# EAGLE design smallDevV2 (EAGLE 6.5.0)
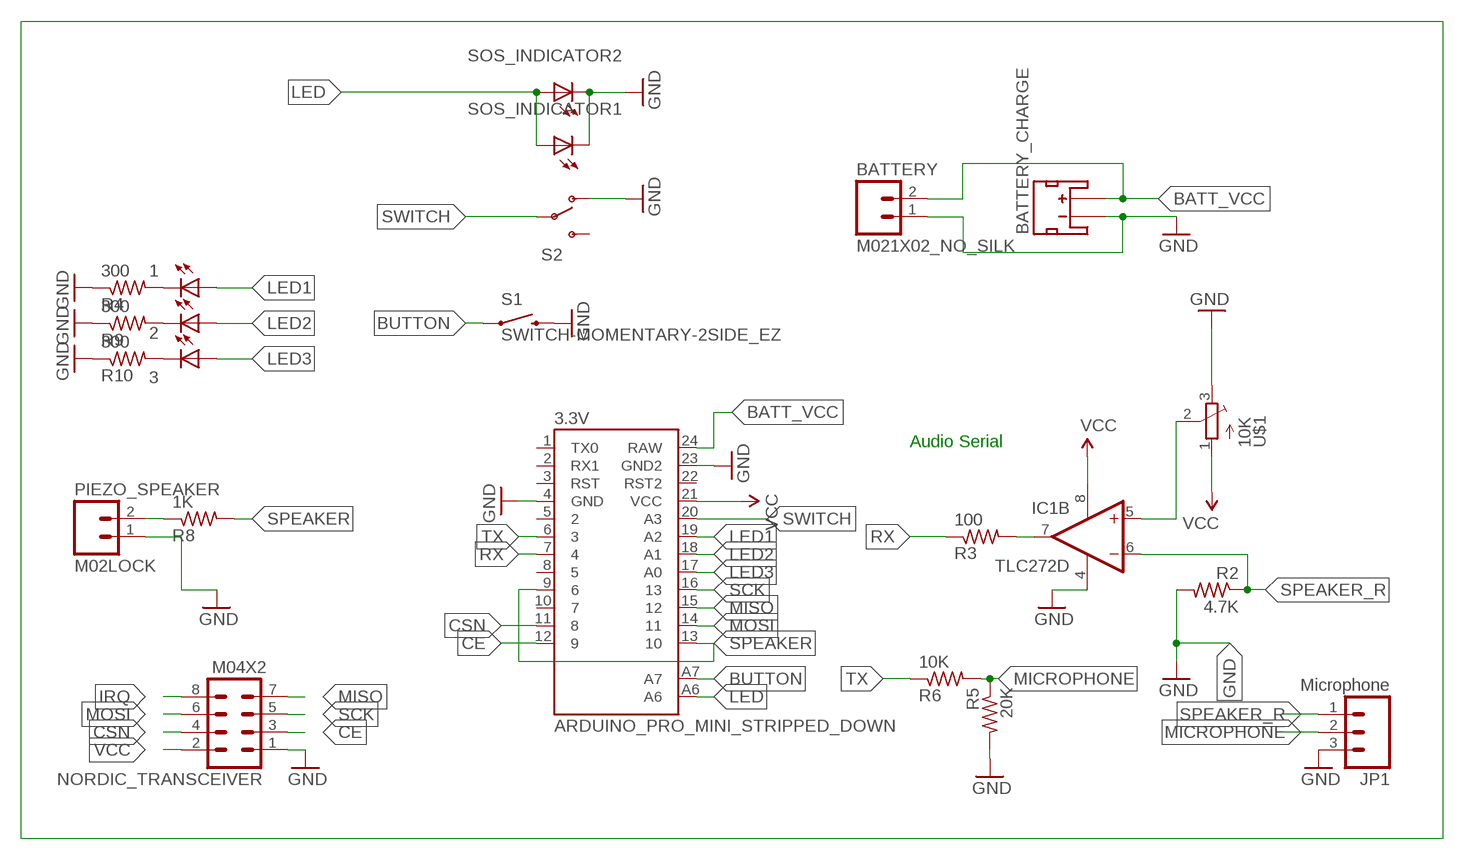
[diagram p0: schematic, sheet 1]

## Parts
1  LEDCHIP-LED0805  [CHIP-LED0805]
2  LEDCHIP-LED0805  [CHIP-LED0805]
3  LEDCHIP-LED0805  [CHIP-LED0805]
3.3V  ARDUINO_PRO_MINI_STRIPPED_DOWN  [ARDUINO_PRO_MINI_STRIPPED_DOWN]
BATTERY  M021X02_NO_SILK  [1X02_NO_SILK]
BATTERY_CHARGE  JST_2MM_MALE  [JST-2-SMD]
IC1  TLC272D  [SO08]
JP1  Microphone  M03LOCK  [1X03_LOCK]
NORDIC_TRANSCEIVER  M04X2  [2X4]
PIEZO_SPEAKER  M02LOCK  [1X02_LOCK]
R2  4.7K  R-US_M0805  [M0805]
R3  100  R-US_M0805  [M0805]
R4  300  R-US_M0805  [M0805]
R5  20K  R-US_M0805  [M0805]
R6  10K  R-US_M0805  [M0805]
R8  1K  R-US_M0805  [M0805]
R9  300  R-US_M0805  [M0805]
R10  300  R-US_M0805  [M0805]
S1  SWITCH-MOMENTARY-2SIDE_EZ  [TACTILE-PTH-SIDEEZ]
S2  SWITCH-SPDT-SMD-A  [SWITCH-SPST-SMD-A]
SOS_INDICATOR1  LEDCHIP-LED0805  [CHIP-LED0805]
SOS_INDICATOR2  LEDCHIP-LED0805  [CHIP-LED0805]
U$1  10K  TRIMPOTTC33X  [TC33X]

## Nets
BATT_VCC: 3.3V.24(RAW) BATTERY.2 BATTERY_CHARGE.2(+)
BUTTON: 3.3V.A7 S1.1
CE: 3.3V.12 NORDIC_TRANSCEIVER.3
CSN: 3.3V.11 NORDIC_TRANSCEIVER.4
GND: 3.3V.4(GND) 3.3V.23(GND2) BATTERY.1 BATTERY_CHARGE.1(-) IC1.4(P:V-) JP1.3 NORDIC_TRANSCEIVER.1 PIEZO_SPEAKER.1 R2.2 R4.1 R5.2 R9.1 R10.1 S1.2 S2.1(O) SOS_INDICATOR1.C SOS_INDICATOR2.C U$1.3(E)
IRQ: NORDIC_TRANSCEIVER.8
LED: 3.3V.A6 SOS_INDICATOR1.A SOS_INDICATOR2.A
LED1: 1.A 3.3V.19(A2)
LED2: 2.A 3.3V.18(A1)
LED3: 3.3V.17(A0) 3.A
MICROPHONE: JP1.2 R5.1 R6.2
MISO: 3.3V.15 NORDIC_TRANSCEIVER.7
MOSI: 3.3V.14 NORDIC_TRANSCEIVER.6
N$3: IC1.5(B:+IN) U$1.2(S)
N$4: IC1.7(B:OUT) R3.2
N$6: 1.C R4.2
N$8: PIEZO_SPEAKER.2 R8.1
N$13: 2.C R9.2
N$14: 3.C R10.2
RX: 3.3V.7 R3.1
SCK: 3.3V.16 NORDIC_TRANSCEIVER.5
SPEAKER: 3.3V.9 3.3V.13 R8.2
SPEAKER_R: IC1.6(B:-IN) JP1.1 R2.1
SWITCH: 3.3V.20(A3) S2.2(P)
TX: 3.3V.6 R6.1
VCC: 3.3V.21(VCC) IC1.8(P:V+) NORDIC_TRANSCEIVER.2 U$1.1(A)
Unconnected: 3.3V.1(TX0) 3.3V.2(RX1) 3.3V.3(RST) 3.3V.5 3.3V.8 3.3V.10 3.3V.22(RST2) BATTERY_CHARGE.NC1(PAD1) BATTERY_CHARGE.NC2(PAD2) IC1.1(A:OUT) IC1.2(A:-IN) IC1.3(A:+IN) S2.3(S)

## Notes on the sheet
- Audio Serial

## Library data of the parts
1-3 SOS_INDICATOR1 SOS_INDICATOR2 = adafruit:LED: LED OSRAM: - CHIPLED LG R971, LG N971, LY N971, LG Q971, LY Q971, LO R971, LY R971 LH N974, LH R974 LS Q976, LO Q976, LY Q976 LO Q996 - Hyper CHIPLED LW Q18S LB Q993, LB Q99A, LB R99A - SideLED LS A670, LO A670, LY A670, LG A670, LP A670 LB A673, LV A673, LT A673, LW A673 LH A674 LY A675 LS A676, LA A676, LO A676, LY A676, LW A676 LS A679, LY A679, LG A679 - Hyper Micro SIDELED® LS Y876, LA Y876, LO Y876, LY Y876 LT Y87S - SmartLED LW L88C, LW L88S LB L89C, LB L89S, LG L890 LS L89K, LO L89K, LY L89K LS L896, LA L896, LO L896, LY L896 - TOPLED LS T670, LO T670, LY T670, LG T670, LP T670 LSG T670, LSP T670, LSY T670, LOP T670, LYG T670 LG T671, LOG T671, LSG T671 LB T673, LV T673, LT T673, LW T673 LH T674 LS T676, LA T676, LO T676, LY T676, LB T676, LH T676, LSB T676, LW T676 LB T67C, LV T67C, LT T67C, LS T67K, LO T67K, LY T67K, LW E67C LS E67B, LA E67B, LO E67B, LY E67B, LB E67C, LV E67C, LT E67C LW T67C LS T679, LY T679, LG T679 LS T770, LO T770, LY T770, LG T770, LP T770 LB T773, LV T773, LT T773, LW T773 LH T774 LS E675, LA E675, LY E675, LS T675 LS T776, LA T776, LO T776, LY T776, LB T776 LHGB T686 LT T68C, LB T68C - Hyper Mini TOPLED® LB M676 - Mini TOPLED Santana® LG M470 LS M47K, LO M47K, LY M47K Source: http://www.osram.convergy.de/
3.3V = myLibrary:ARDUINO_PRO_MINI_STRIPPED_DOWN
BATTERY PIEZO_SPEAKER = SparkFun-Connectors:M02: Standard 2-pin 0.1" header. Use with - straight break away headers ( PRT-00116) - right angle break away headers (PRT-00553) - swiss pins (PRT-00743) - machine pins (PRT-00117) - female headers (PRT-00115) Molex polarized connector foot print use with: PRT-08233 with associated crimp pins and housings. 2.54_SCREWTERM for use with PRT-10571. 3.5mm Screw Terminal footprints for PRT-08084 5mm Screw Terminal footprints for use with PRT-08433
BATTERY_CHARGE = SparkFun-Connectors:JST_2MM_MALE: Mates to single-cell LiPo batteries. CONN-08352; PROD_ID: CONN-08352
IC1 = linear:TLC272: OP AMP
JP1 = SparkFun-Connectors:M03: Header 3 Standard 3-pin 0.1" header. Use with straight break away headers (SKU : PRT-00116), right angle break away headers (PRT-00553), swiss pins (PRT-00743), machine pins (PRT-00117), and female headers (PRT-00115). Molex polarized connector foot print use with SKU : PRT-08232 with associated crimp pins and housings.
NORDIC_TRANSCEIVER = SparkFun-Connectors:M04X2: .1" header, two rows of four.
R2-R6 R8-R10 = adafruit:R-US_: RESISTOR, American symbol
S1 = SparkFun-Electromechanical:SWITCH-MOMENTARY-2: Various NO switches- pushbuttons, reed, etc
S2 = SparkFun-Electromechanical:SWITCH-SPDT: SPDT Switch Simple slide switch, Spark Fun Electronics SKU : COM-00102 DPDT SMT slide switch, AYZ0202, SWCH-08179
U$1 = adafruit:TRIMPOT: SMT trimmer potentiometer part number TC33X http://www.ladyada.net/library/eagle

## Board
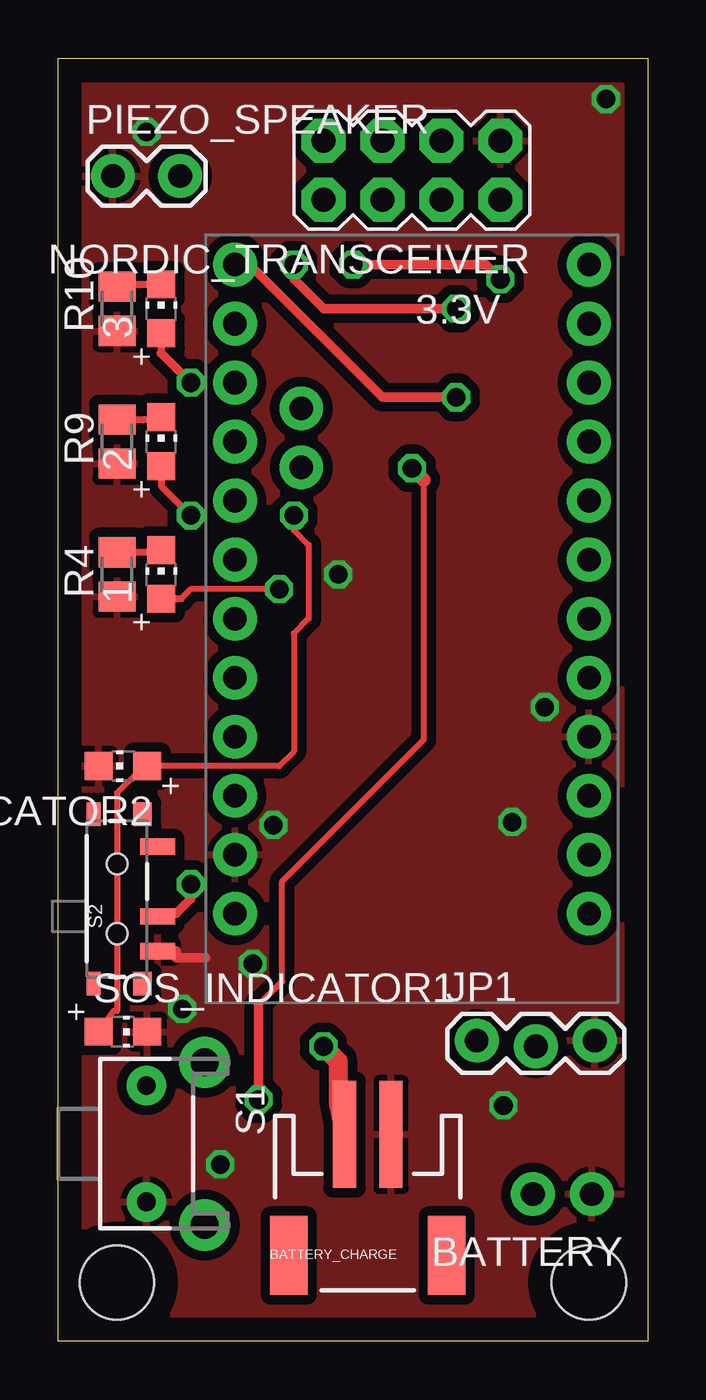
[diagram p1: board, top side]
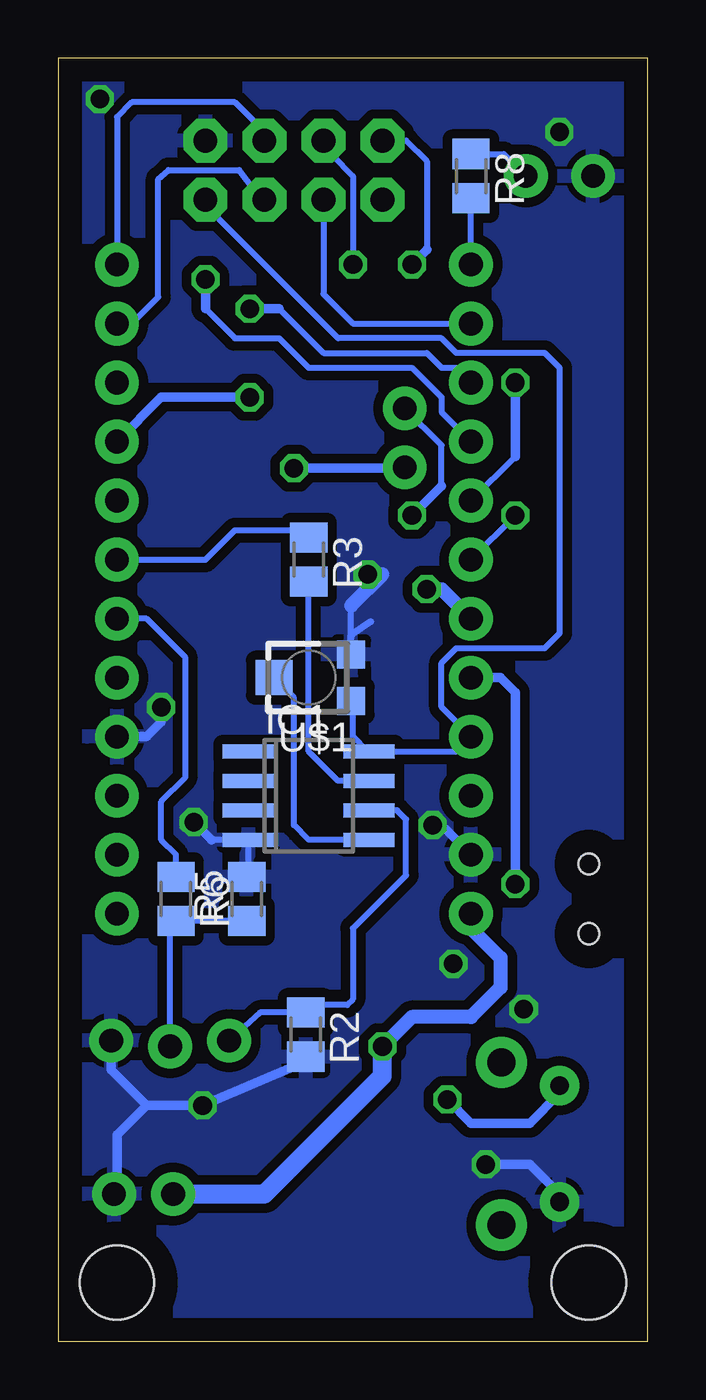
[diagram p2: board, bottom side, seen from below]

Size 25.4 x 55.24 mm. Coordinates in mm from the lower left corner, seen from the top.
Outline: 0,0 0,55.24 25.4,55.24 25.4,0 0,0
Copper layers (1*16): Top 0.035mm / dielectric 1.5mm / Bottom 0.035mm
Design rules "default": minimum track width 10mil, minimum drill 24mil, track to track 8mil, track to pad 8mil, pad to pad 8mil, via to via 8mil, smd to smd 8mil, copper to edge 40mil, drill to drill 8mil, minimum pad ring 10mil, minimum via ring 8mil, stop-mask expansion 4mil, vias tented up to drill 0mil, thermal gap 10mil
Holes 3.2 mm at 2.54,2.54 22.86,2.54

### Footprints (pad centres in the part's own frame; a part is rotated, then mirrored left to right if it is on the bottom)
CHIP-LED0805 = smd 1.2 x 1.2: A 0,-1.05; C 0,1.05
ARDUINO_PRO_MINI_STRIPPED_DOWN = drill 1.016 pad 1.88: 1 -7.62,13.97; 2 -7.62,11.43; 3 -7.62,8.89; 4 -7.62,6.35; 5 -7.62,3.81; 6 -7.62,1.27; 7 -7.62,-1.27; 8 -7.62,-3.81; 9 -7.62,-6.35; 10 -7.62,-8.89; 11 -7.62,-11.43; 12 -7.62,-13.97; 13 7.62,-13.97; 14 7.62,-11.43; 15 7.62,-8.89; 16 7.62,-6.35; 17 7.62,-3.81; 18 7.62,-1.27; 19 7.62,1.27; 20 7.62,3.81; 21 7.62,6.35; 22 7.62,8.89; 23 7.62,11.43; 24 7.62,13.97; A6 4.763,-7.779; A7 4.763,-5.239
1X02_NO_SILK = drill 1.016 pad 1.88: 1 0,0; 2 2.54,0
JST-2-SMD = smd 1 x 4.6: 1 -1,-3.7; 2 1,-3.7 | smd 1.6 x 3.4: NC1 -3.4,1.5; NC2 3.4,1.5
SO08 = smd 0.6 x 2.2: 1 -1.905,-2.6; 2 -0.635,-2.6; 3 0.635,-2.6; 4 1.905,-2.6; 5 1.905,2.6; 6 0.635,2.6; 7 -0.635,2.6; 8 -1.905,2.6
1X03_LOCK = drill 1.016 pad 1.88: 1 0,0.127; 2 2.54,-0.127; 3 5.08,0.127
2X4 = drill 1.016 pad 1.88 octagon: 1 -3.81,-1.27; 2 -3.81,1.27; 3 -1.27,-1.27; 4 -1.27,1.27; 5 1.27,-1.27; 6 1.27,1.27; 7 3.81,-1.27; 8 3.81,1.27
1X02_LOCK = drill 1.016 pad 1.88: 1 -0.178,0; 2 2.718,0
M0805 = smd 1.3 x 1.6: 1 -0.95,0; 2 0.95,0
TACTILE-PTH-SIDEEZ = drill 0.8 pad 1.7: 1 -2.5,0; 2 2.5,0 | drill 1.2 pad 2.2: ANCHOR1 -3.5,2.5; ANCHOR2 3.5,2.5
SWITCH-SPST-SMD-A = smd 0.7 x 1.5: 1 -2.25,-1.75; 2 -0.75,-1.75; 3 2.25,-1.75 | smd 1 x 0.6: GND1 -3.65,1; GND3 3.65,1 | smd 1 x 0.8: GND2 -3.65,-1.1; GND4 3.65,-1.1 | hole 0.9: -1.5,0; 1.5,0
TC33X = smd 1.2 x 1.2: 1 -1,-1.825; 3 1,-1.825 | smd 1.5 x 1.6: 2 0,1.5

### Placement (x,y rotation side)
1  4.45,33.02 0 top
2  4.45,38.73 0 top
3  4.45,44.45 0 top
3.3V  15.24,32.38 180 top
BATTERY  22.99,6.35 180 top
BATTERY_CHARGE  13.34,5.21 180 top
IC1  14.61,23.5 270 bottom
JP1  18.03,12.83 0 top
NORDIC_TRANSCEIVER  15.24,50.42 180 top
PIEZO_SPEAKER  2.54,50.16 0 top
R2  14.73,13.21 270 bottom
R3  14.61,33.66 270 bottom
R4  2.54,33.02 90 top
R5  17.27,19.05 90 bottom
R6  20.32,19.05 270 bottom
R8  7.62,50.16 270 bottom
R9  2.54,38.73 90 top
R10  2.54,44.45 90 top
S1  3.81,8.51 270 top
S2  2.54,19.05 90 top
SOS_INDICATOR1  2.79,13.34 270 top
SOS_INDICATOR2  2.79,24.77 90 top
U$1  14.61,28.57 90 bottom

### Tracks (layer width: path | path; a pad name or v marks a point on that pad's centre or on a via)
BATT_VCC  (via drill 0.8)
  Top 0.813: v11.43,12.7 12.06,12.06 12.06,10.32 BATTERY_CHARGE.2
  Bottom 0.61: v11.43,12.7 10.16,13.97 7.62,13.97 6.35,15.24 6.35,16.51 7.62,17.78 3.3V.24
  Bottom 0.813: BATTERY.2 16.51,6.35 11.43,11.43 v11.43,12.7
BUTTON  (via drill 0.8)
  Top 0.254: 8.64,14.48 9.65,15.49 9.65,19.81 15.75,25.91 15.75,37.08
  Top 0.406: v8.64,10.41 8.64,14.48
  Top 0.61: 15.75,37.08 v15.24,37.59
  Bottom 0.254: 10.51,37.59 3.3V.A7
  Bottom 0.406: S1.1 3.81,10.67 5.08,9.4 7.62,9.4 v8.64,10.41 | v15.24,37.59 10.51,37.59
CE
  Bottom 0.254: NORDIC_TRANSCEIVER.3 16.51,52.07 17.78,53.34 22.23,53.34 22.86,52.7 3.3V.12
CSN
  Bottom 0.254: NORDIC_TRANSCEIVER.4 16.64,49.15 17.6,50.42 20.65,50.42 21.08,50.04 21.08,44.96 22.23,43.81 3.3V.11
GND  (via drill 0.8)
  Top 0.406: S2.1 5.08,16.8 5.08,16.51 6.35,16.51
  Bottom 0.254: U$1.3 12.78,31.67 | R2.2 14.73,12.06 | R5.2 17.2,20 IC1.4 18.8,21.59
  Bottom 0.305: U$1.3 12.78,30.4 12.7,30.48 11.94,30.99
  Bottom 0.406: 14.73,12.06 v19.18,10.16 21.59,10.16 | 18.8,21.59 v19.56,22.35 | S1.2 3.81,6.35 5.08,7.62 v6.99,7.62 | v9.27,22.23 8.89,22.23 3.3V.23 | v20.95,27.3 20.95,26.67 21.59,26.04 3.3V.4 | 21.59,10.16 22.86,8.89 22.86,6.48 BATTERY.1 | JP1.3 23.11,11.68 21.59,10.16
  Bottom 0.61: 12.78,31.67 11.43,33.02
  other vias: 23.6,53.48 3.81,52.07 8.38,16.26 5.35,14.31 12.06,33.02
  pour Top (isolate 0.406): -1.27,54.61 26.67,54.61 26.67,-1.27 -1.27,-1.27
  pour Bottom (isolate 0.406): -1.27,55.88 26.67,55.88 26.67,-1.27 -1.27,-1.27
LED  (via drill 0.8)
  Top 0.254: SOS_INDICATOR2.A 3.59,24.67 2.54,23.62 2.54,14.22 2.38,14.22 SOS_INDICATOR1.A | 3.85,24.76 SOS_INDICATOR2.A | v10.16,35.56 10.16,34.92 10.79,34.29 10.79,31.11 10.16,30.48 10.16,25.4 9.53,24.77 SOS_INDICATOR2.A
  Bottom 0.254: 8.89,36.83 8.89,38.58 3.3V.A6
  Bottom 0.406: 8.89,36.83 v10.16,35.56
LED1  (via drill 0.8)
  Top 0.254: v9.53,32.38 5.71,32.38 5.3,31.97
  Top 0.305: 1.A 5.3,31.97
  Bottom 0.61: v9.53,32.38 8.89,32.38 3.3V.19
LED2  (via drill 0.8)
  Top 0.305: 2.A 4.45,36.83 v5.71,35.56
  Bottom 0.254: v5.71,35.56 3.3V.18
LED3  (via drill 0.8)
  Top 0.305: 3.A 4.45,42.55
  Top 0.406: 4.45,42.55 v5.71,41.27
  Bottom 0.254: 5.71,38.1 3.3V.17
  Bottom 0.406: v5.71,41.27 5.71,38.1
MICROPHONE
  Bottom 0.254: JP1.2 20.57,17.85 R6.2 R5.1
MISO  (via drill 0.8)
  Top 0.406: v10.16,46.35 10.16,45.72 11.43,44.45 v17.14,44.45
  Bottom 0.254: NORDIC_TRANSCEIVER.7 10.41,51.69 9.53,50.8 9.53,46.99 | 15.88,44.45 13.97,42.55 9.53,42.55 8.89,41.91 8.26,41.91 3.3V.15
  Bottom 0.406: 9.53,46.99 v10.16,46.35 | v17.14,44.45 15.88,44.45
MOSI
  Bottom 0.254: NORDIC_TRANSCEIVER.6 13.97,45.09 12.7,43.81 3.3V.14
N$3
  Bottom 0.254: IC1.5 14.61,21.59 15.24,22.23 15.24,27.71 U$1.2
N$4
  Bottom 0.254: IC1.7 13.34,24.13 14.61,25.4 R3.2
N$6
  Top 0.305: R4.2 4.34,33.97 1.C
N$8
  Bottom 0.254: R8.1 6.21,51.12 PIEZO_SPEAKER.2
N$13
  Top 0.305: R9.2 3.71,39.69 2.C
N$14
  Top 0.305: 3.C 2,45.5 R10.2
RX
  Bottom 0.254: 3.3V.7 19.05,33.66 17.78,34.92 14.93,34.92 R3.1
SCK  (via drill 0.8)
  Top 0.406: v12.7,46.35 18.41,46.35 v19.05,45.72
  Bottom 0.254: NORDIC_TRANSCEIVER.5 13.59,51.69 13.59,51.05 12.7,50.16 v12.7,46.35 | 3.3V.16 8.89,40.01 8.89,40.64 10.16,41.91 14.61,41.91 15.88,43.18 17.78,43.18 19.05,44.45
  Bottom 0.406: 19.05,44.45 v19.05,45.72
SPEAKER  (via drill 0.8)
  Top 0.406: 3.3V.13 8.26,46.35 13.97,40.64 v17.14,40.64
  Bottom 0.254: 3.3V.13 R8.2
  Bottom 0.406: v17.14,40.64 20.95,40.64 3.3V.9
SPEAKER_R
  Bottom 0.254: IC1.6 10.79,22.86 10.41,22.48 10.41,20.07 12.7,17.78 12.7,14.73 12.95,14.48 14.41,14.48 R2.1 16.7,14.16 JP1.1
SWITCH  (via drill 0.8)
  Top 0.406: v5.71,19.68 5.71,19.05 5.08,18.41 4.41,18.41 S2.2
  Bottom 0.406: 3.3V.20 6.35,28.57 5.71,27.94 v5.71,19.68
TX
  Bottom 0.254: R6.1 20.32,20.95 20.95,21.59 20.95,23.24 19.94,24.26 19.94,29.46 21.59,31.11 3.3V.6
VCC
  Bottom 0.254: U$1.1 12.7,27.5 12.7,26.04 12.06,25.4 IC1.8 8.26,25.4 3.3V.21 8.89,27.3 8.89,29.21 8.26,29.84 4.45,29.84 3.81,30.48 3.81,41.91 4.45,42.55 8.26,42.55 8.89,43.18 13.34,43.18 18.41,48.26 NORDIC_TRANSCEIVER.2